# EAGLE schematic PGTN_daisy1_controls_8cvin_2cvout (EAGLE 9.6.0)
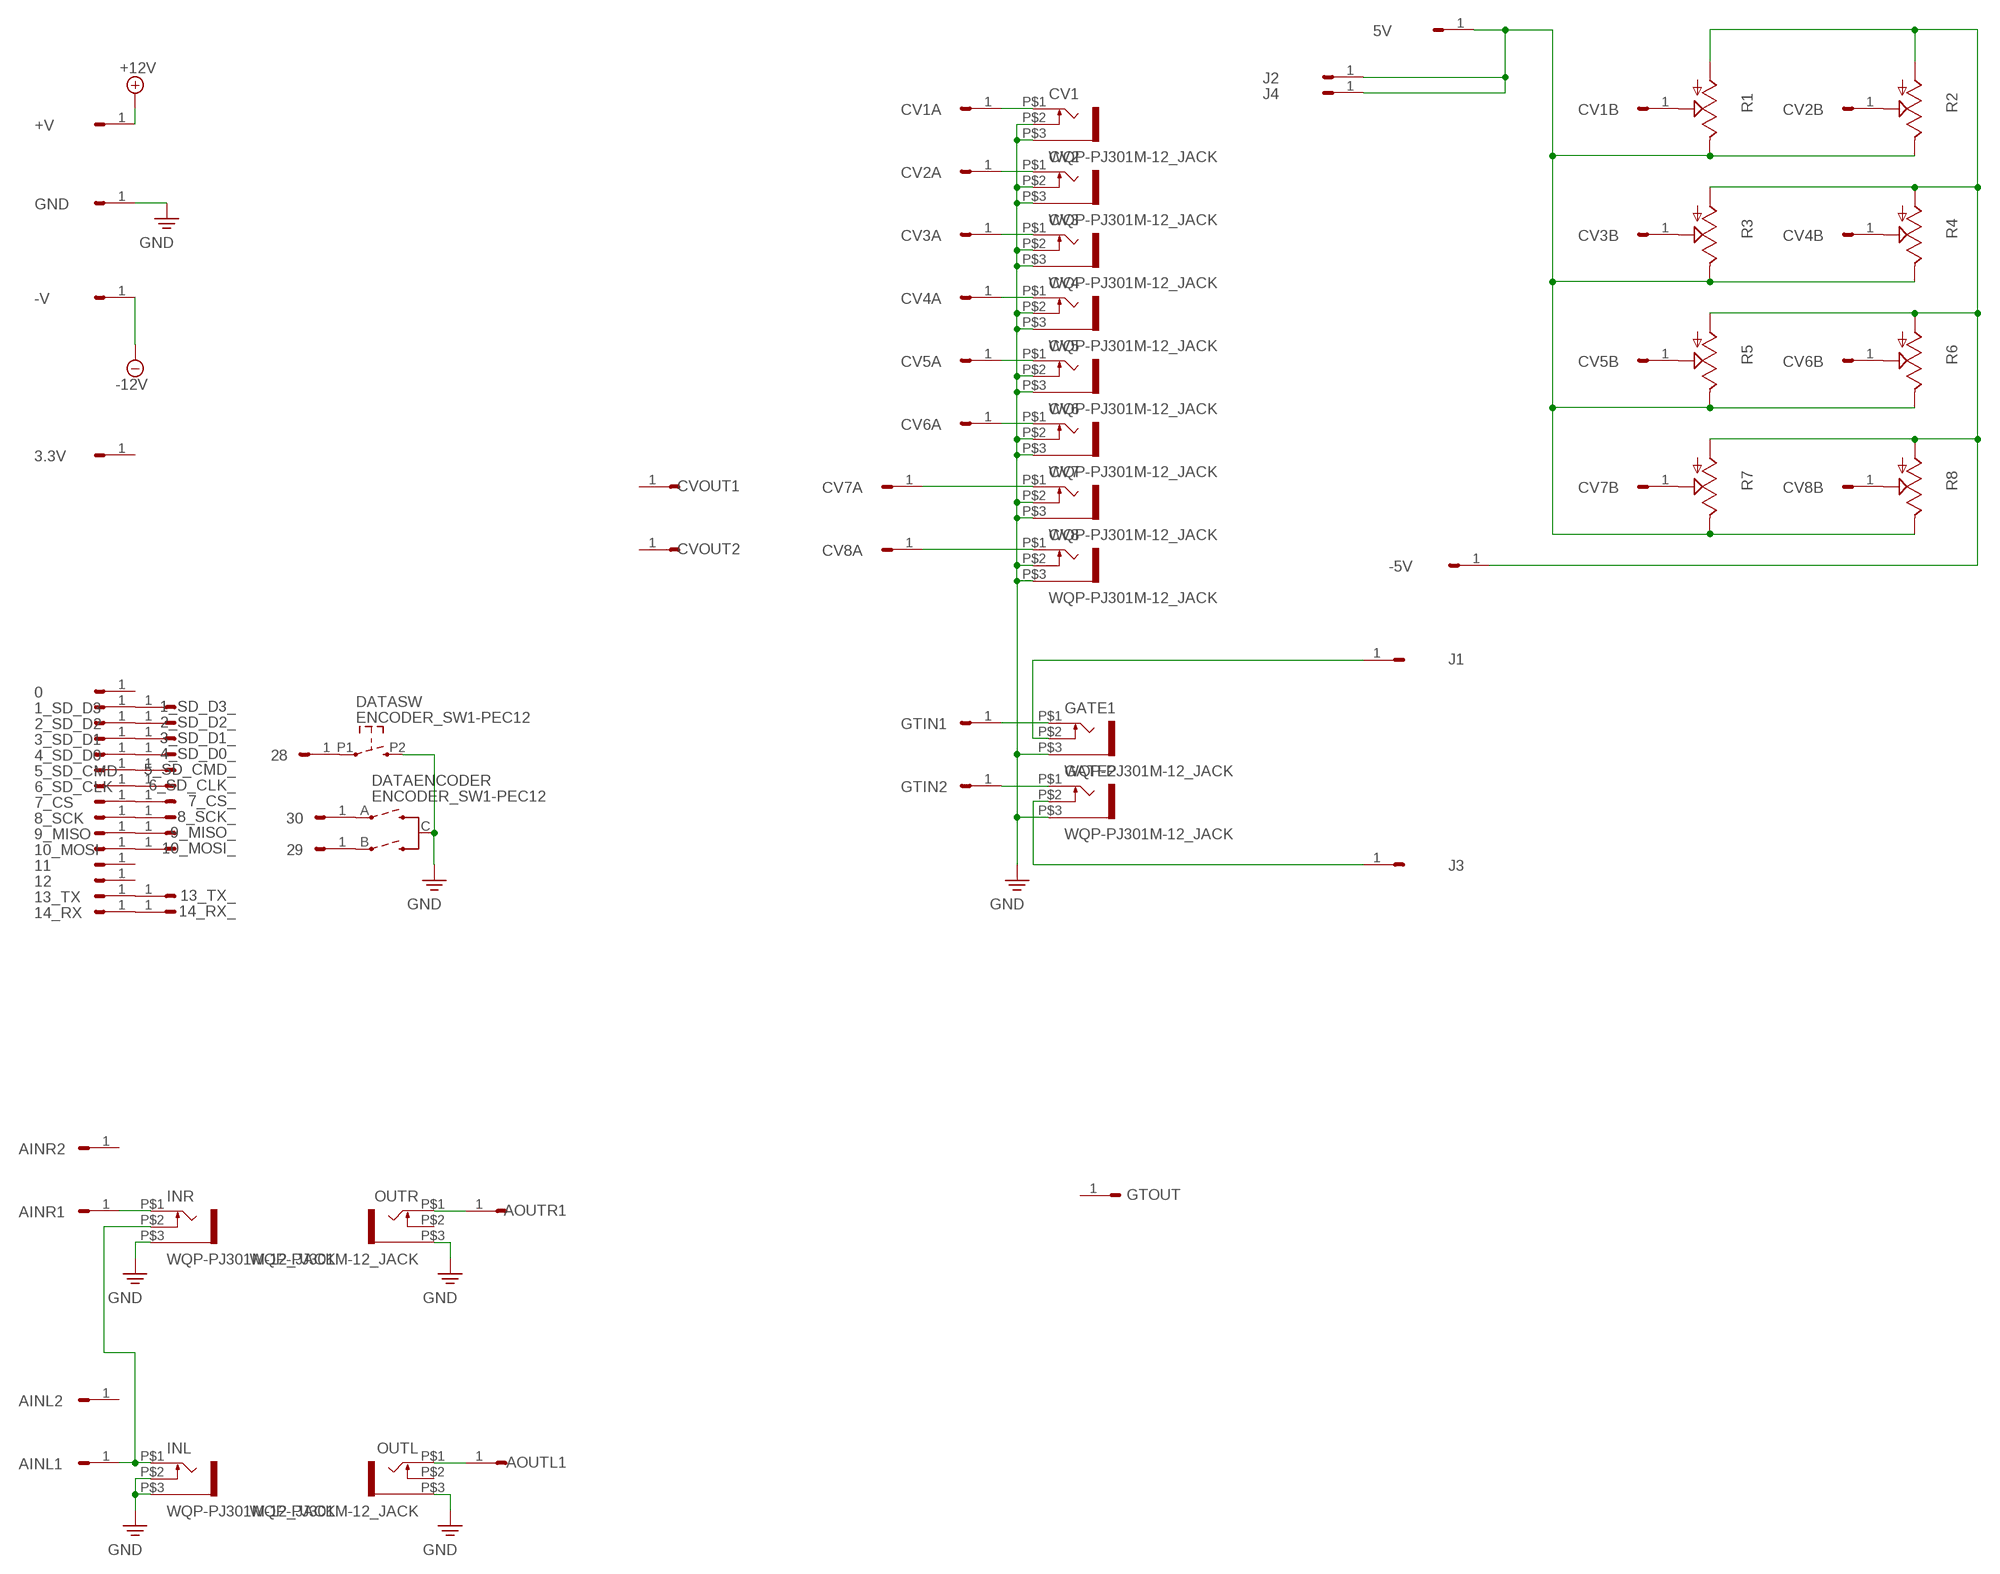
[diagram p0: schematic, sheet 1]

## Parts
0  HEADER/MALE/01  [HEADER/MALE/01]
1_SD_D3  HEADER/MALE/01  [HEADER/MALE/01]
1_SD_D3_  HEADER/MALE/01  [HEADER/MALE/01]
2_SD_D2  HEADER/MALE/01  [HEADER/MALE/01]
2_SD_D2_  HEADER/MALE/01  [HEADER/MALE/01]
3.3V  HEADER/MALE/01  [HEADER/MALE/01]
3_SD_D1  HEADER/MALE/01  [HEADER/MALE/01]
3_SD_D1_  HEADER/MALE/01  [HEADER/MALE/01]
4_SD_D0  HEADER/MALE/01  [HEADER/MALE/01]
4_SD_D0_  HEADER/MALE/01  [HEADER/MALE/01]
5_SD_CMD  HEADER/MALE/01  [HEADER/MALE/01]
5_SD_CMD_  HEADER/MALE/01  [HEADER/MALE/01]
5V  HEADER/MALE/01  [HEADER/MALE/01]
6_SD_CLK  HEADER/MALE/01  [HEADER/MALE/01]
6_SD_CLK_  HEADER/MALE/01  [HEADER/MALE/01]
7_CS  HEADER/MALE/01  [HEADER/MALE/01]
7_CS_  HEADER/MALE/01  [HEADER/MALE/01]
8_SCK  HEADER/MALE/01  [HEADER/MALE/01]
8_SCK_  HEADER/MALE/01  [HEADER/MALE/01]
9_MISO  HEADER/MALE/01  [HEADER/MALE/01]
9_MISO_  HEADER/MALE/01  [HEADER/MALE/01]
10_MOSI  HEADER/MALE/01  [HEADER/MALE/01]
10_MOSI_  HEADER/MALE/01  [HEADER/MALE/01]
11  HEADER/MALE/01  [HEADER/MALE/01]
12  HEADER/MALE/01  [HEADER/MALE/01]
13_TX  HEADER/MALE/01  [HEADER/MALE/01]
13_TX_  HEADER/MALE/01  [HEADER/MALE/01]
14_RX  HEADER/MALE/01  [HEADER/MALE/01]
14_RX_  HEADER/MALE/01  [HEADER/MALE/01]
28  HEADER/MALE/01  [HEADER/MALE/01]
29  HEADER/MALE/01  [HEADER/MALE/01]
30  HEADER/MALE/01  [HEADER/MALE/01]
+V  HEADER/MALE/01  [HEADER/MALE/01]
-5V  HEADER/MALE/01  [HEADER/MALE/01]
-V  HEADER/MALE/01  [HEADER/MALE/01]
AINL1  HEADER/MALE/01  [HEADER/MALE/01]
AINL2  HEADER/MALE/01  [HEADER/MALE/01]
AINR1  HEADER/MALE/01  [HEADER/MALE/01]
AINR2  HEADER/MALE/01  [HEADER/MALE/01]
AOUTL1  HEADER/MALE/01  [HEADER/MALE/01]
AOUTR1  HEADER/MALE/01  [HEADER/MALE/01]
CV1  WQP-PJ301M-12_JACK  [WQP-PJ301M-12_JACK]
CV1A  HEADER/MALE/01  [HEADER/MALE/01]
CV1B  HEADER/MALE/01  [HEADER/MALE/01]
CV2  WQP-PJ301M-12_JACK  [WQP-PJ301M-12_JACK]
CV2A  HEADER/MALE/01  [HEADER/MALE/01]
CV2B  HEADER/MALE/01  [HEADER/MALE/01]
CV3  WQP-PJ301M-12_JACK  [WQP-PJ301M-12_JACK]
CV3A  HEADER/MALE/01  [HEADER/MALE/01]
CV3B  HEADER/MALE/01  [HEADER/MALE/01]
CV4  WQP-PJ301M-12_JACK  [WQP-PJ301M-12_JACK]
CV4A  HEADER/MALE/01  [HEADER/MALE/01]
CV4B  HEADER/MALE/01  [HEADER/MALE/01]
CV5  WQP-PJ301M-12_JACK  [WQP-PJ301M-12_JACK]
CV5A  HEADER/MALE/01  [HEADER/MALE/01]
CV5B  HEADER/MALE/01  [HEADER/MALE/01]
CV6  WQP-PJ301M-12_JACK  [WQP-PJ301M-12_JACK]
CV6A  HEADER/MALE/01  [HEADER/MALE/01]
CV6B  HEADER/MALE/01  [HEADER/MALE/01]
CV7  WQP-PJ301M-12_JACK  [WQP-PJ301M-12_JACK]
CV7A  HEADER/MALE/01  [HEADER/MALE/01]
CV7B  HEADER/MALE/01  [HEADER/MALE/01]
CV8  WQP-PJ301M-12_JACK  [WQP-PJ301M-12_JACK]
CV8A  HEADER/MALE/01  [HEADER/MALE/01]
CV8B  HEADER/MALE/01  [HEADER/MALE/01]
CVOUT1  HEADER/MALE/01  [HEADER/MALE/01]
CVOUT2  HEADER/MALE/01  [HEADER/MALE/01]
DATA  ENCODER_SW1-PEC12  [PEC12_INCREMENTAL_ENCODER]
GATE1  WQP-PJ301M-12_JACK  [WQP-PJ301M-12_JACK]
GATE2  WQP-PJ301M-12_JACK  [WQP-PJ301M-12_JACK]
GND  HEADER/MALE/01  [HEADER/MALE/01]
GTIN1  HEADER/MALE/01  [HEADER/MALE/01]
GTIN2  HEADER/MALE/01  [HEADER/MALE/01]
GTOUT  HEADER/MALE/01  [HEADER/MALE/01]
INL  WQP-PJ301M-12_JACK  [WQP-PJ301M-12_JACK]
INR  WQP-PJ301M-12_JACK  [WQP-PJ301M-12_JACK]
J1  HEADER/MALE/01  [HEADER/MALE/01]
J2  HEADER/MALE/01  [HEADER/MALE/01]
J3  HEADER/MALE/01  [HEADER/MALE/01]
J4  HEADER/MALE/01  [HEADER/MALE/01]
OUTL  WQP-PJ301M-12_JACK  [WQP-PJ301M-12_JACK]
OUTR  WQP-PJ301M-12_JACK  [WQP-PJ301M-12_JACK]
R1  9MM_SNAP-IN_POT_  [9MM_SNAP-IN_POT]
R2  9MM_SNAP-IN_POT_  [9MM_SNAP-IN_POT]
R3  9MM_SNAP-IN_POT_  [9MM_SNAP-IN_POT]
R4  9MM_SNAP-IN_POT_  [9MM_SNAP-IN_POT]
R5  9MM_SNAP-IN_POT_  [9MM_SNAP-IN_POT]
R6  9MM_SNAP-IN_POT_  [9MM_SNAP-IN_POT]
R7  9MM_SNAP-IN_POT_  [9MM_SNAP-IN_POT]
R8  9MM_SNAP-IN_POT_  [9MM_SNAP-IN_POT]

## Nets
+12V: +V.1
-12V: -V.1
N$1: AOUTR1.1 OUTR.P$1
N$2: AINR1.1 INR.P$1
N$3: CV1.P$1 CV1A.1
N$4: AINL1.1 INL.P$1 INR.P$2
N$5: CV1B.1 R1.2(S)
N$6: CV2.P$1 CV2A.1
N$7: CV3.P$1 CV3A.1
N$8: CV4.P$1 CV4A.1
N$9: CV5.P$1 CV5A.1
N$10: CV6.P$1 CV6A.1
N$11: CV7.P$1 CV7A.1
N$12: CV8.P$1 CV8A.1
N$13: GATE1.P$1 GTIN1.1
N$14: GATE2.P$1 GTIN2.1
N$15: CV3B.1 R3.2(S)
N$16: CV4B.1 R4.2(S)
N$17: CV5B.1 R5.2(S)
N$18: CV6B.1 R6.2(S)
N$19: CV7B.1 R7.2(S)
N$20: CV8B.1 R8.2(S)
N$22: CV2B.1 R2.2(S)
N$23: -5V.1 R1.1(A) R2.1(A) R3.1(A) R4.1(A) R5.1(A) R6.1(A) R7.1(A) R8.1(A)
N$25: 30.1 DATA.A(ENCODER:A)
N$26: 29.1 DATA.B(ENCODER:B)
N$27: 28.1 DATA.P1
N$28: 7_CS.1 7_CS_.1
N$29: 8_SCK.1 8_SCK_.1
N$30: 9_MISO.1 9_MISO_.1
N$31: 10_MOSI.1 10_MOSI_.1
N$32: GATE1.P$2 J1.1
N$33: GATE2.P$2 J3.1
N$34: 6_SD_CLK.1 6_SD_CLK_.1
N$35: 5_SD_CMD.1 5_SD_CMD_.1
N$36: 4_SD_D0.1 4_SD_D0_.1
N$37: 3_SD_D1.1 3_SD_D1_.1
N$38: 2_SD_D2.1 2_SD_D2_.1
N$39: 1_SD_D3.1 1_SD_D3_.1
N$40: 13_TX.1 13_TX_.1
N$41: 14_RX.1 14_RX_.1
N$42: AOUTL1.1 OUTL.P$1
N$44: 5V.1 J2.1 J4.1 R1.3(E) R2.3(E) R3.3(E) R4.3(E) R5.3(E) R6.3(E) R7.3(E) R8.3(E)
PE: CV1.P$2 CV1.P$3 CV2.P$2 CV2.P$3 CV3.P$2 CV3.P$3 CV4.P$2 CV4.P$3 CV5.P$2 CV5.P$3 CV6.P$2 CV6.P$3 CV7.P$2 CV7.P$3 CV8.P$2 CV8.P$3 DATA.C(ENCODER:C) DATA.P2 GATE1.P$3 GATE2.P$3 GND.1 INL.P$2 INL.P$3 INR.P$3 OUTL.P$3 OUTR.P$3 ; supply symbol labelled GND
Unconnected: 0.1 3.3V.1 11.1 12.1 AINL2.1 AINR2.1 CVOUT1.1 CVOUT2.1 GTOUT.1 OUTL.P$2 OUTR.P$2

## Library data of the parts
0 1_SD_D3 1_SD_D3_ 2_SD_D2 2_SD_D2_ 3.3V 3_SD_D1 3_SD_D1_ 4_SD_D0 4_SD_D0_ 5_SD_CMD 5_SD_CMD_ 5V 6_SD_CLK 6_SD_CLK_ 7_CS 7_CS_ 8_SCK 8_SCK_ 9_MISO 9_MISO_ 10_MOSI 10_MOSI_ 11 12 13_TX 13_TX_ 14_RX 14_RX_ 28-30 +V -5V -V AINL1 AINL2 AINR1 AINR2 AOUTL1 AOUTR1 CV1A CV1B CV2A CV2B CV3A CV3B CV4A CV4B CV5A CV5B CV6A CV6B CV7A CV7B CV8A CV8B CVOUT1 CVOUT2 GND GTIN1 GTIN2 GTOUT J1-J4 = connectors:HEADER/MALE/01; SPICEPREFIX: X
CV1-CV8 GATE1 GATE2 INL INR OUTL OUTR = controls:WQP-PJ301M-12_JACK
DATA = controls:ENCODER_SW1: Incremental Encoder with push switch
R1-R8 = controls:9MM_SNAP-IN_POT: 9mm vertical snap-in pot, Alpha / Panasonic style